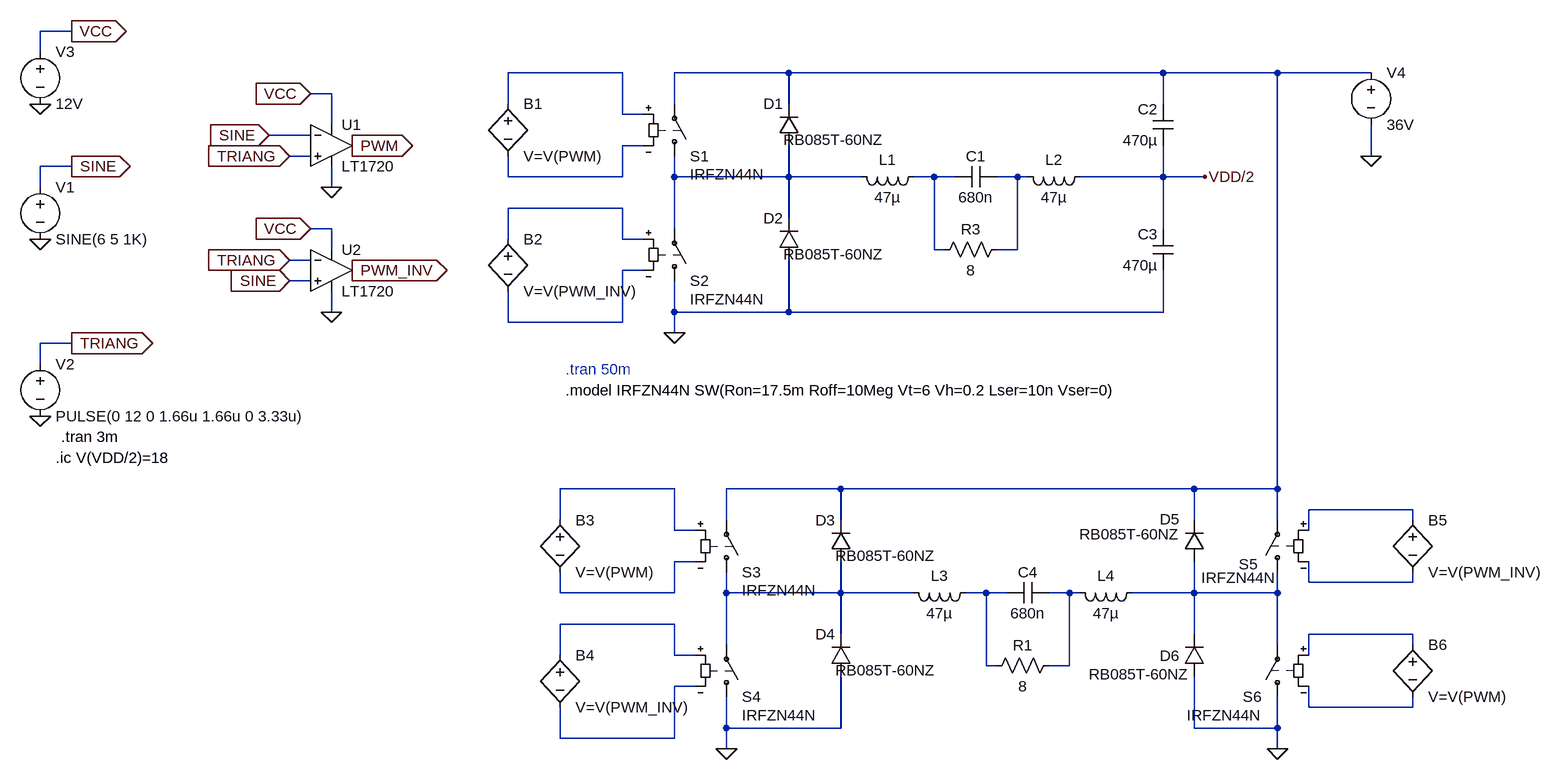
[diagram p0: schematic Draft1.asc]
Draft1.asc, the LTspice schematic file:
Version 4.1
SHEET 1 1736 832
WIRE -656 -416 -704 -416
WIRE -704 -384 -704 -416
WIRE 192 -352 16 -352
WIRE 448 -352 272 -352
WIRE 1024 -352 448 -352
WIRE 1200 -352 1024 -352
WIRE 1344 -352 1200 -352
WIRE -256 -320 -288 -320
WIRE 16 -304 16 -352
WIRE 272 -304 272 -352
WIRE 448 -304 448 -352
WIRE 1024 -304 1024 -352
WIRE 192 -288 192 -352
WIRE 224 -288 192 -288
WIRE -256 -272 -256 -320
WIRE -288 -256 -352 -256
WIRE 224 -240 192 -240
WIRE -288 -224 -320 -224
WIRE 1344 -224 1344 -272
WIRE -656 -208 -704 -208
WIRE 16 -192 16 -224
WIRE 192 -192 192 -240
WIRE 192 -192 16 -192
WIRE 272 -192 272 -224
WIRE 448 -192 448 -240
WIRE 448 -192 272 -192
WIRE 560 -192 448 -192
WIRE 672 -192 640 -192
WIRE 704 -192 672 -192
WIRE 800 -192 768 -192
WIRE 816 -192 800 -192
WIRE 1024 -192 1024 -240
WIRE 1024 -192 896 -192
WIRE 1088 -192 1024 -192
WIRE -704 -176 -704 -208
WIRE -256 -176 -256 -208
WIRE 192 -144 16 -144
WIRE 448 -128 448 -192
WIRE -256 -112 -288 -112
WIRE 272 -112 272 -192
WIRE 1024 -112 1024 -192
WIRE 16 -96 16 -144
WIRE 192 -96 192 -144
WIRE 224 -96 192 -96
WIRE -256 -80 -256 -112
WIRE 672 -80 672 -192
WIRE 688 -80 672 -80
WIRE 800 -80 800 -192
WIRE 800 -80 768 -80
WIRE -288 -64 -320 -64
WIRE 224 -48 192 -48
WIRE -288 -32 -320 -32
WIRE -256 16 -256 -16
WIRE 272 16 272 -32
WIRE 448 16 448 -64
WIRE 448 16 272 16
WIRE 1024 16 1024 -48
WIRE 1024 16 448 16
WIRE 16 32 16 -16
WIRE 192 32 192 -48
WIRE 192 32 16 32
WIRE 272 48 272 16
WIRE -656 64 -704 64
WIRE -704 96 -704 64
WIRE 272 288 96 288
WIRE 528 288 352 288
WIRE 1072 288 528 288
WIRE 1200 288 1200 -352
WIRE 1200 288 1072 288
WIRE 1408 320 1248 320
WIRE 96 336 96 288
WIRE 352 336 352 288
WIRE 528 336 528 288
WIRE 1072 336 1072 288
WIRE 1200 336 1200 288
WIRE 1408 336 1408 320
WIRE 272 352 272 288
WIRE 304 352 272 352
WIRE 1248 352 1248 320
WIRE 304 400 272 400
WIRE 1248 432 1248 400
WIRE 1408 432 1408 416
WIRE 1408 432 1248 432
WIRE 96 448 96 416
WIRE 272 448 272 400
WIRE 272 448 96 448
WIRE 352 448 352 416
WIRE 528 448 528 400
WIRE 528 448 352 448
WIRE 640 448 528 448
WIRE 752 448 720 448
WIRE 784 448 752 448
WIRE 880 448 848 448
WIRE 896 448 880 448
WIRE 1072 448 1072 400
WIRE 1072 448 976 448
WIRE 1200 448 1200 416
WIRE 1200 448 1072 448
WIRE 272 496 96 496
WIRE 528 512 528 448
WIRE 1072 512 1072 448
WIRE 1408 512 1248 512
WIRE 352 528 352 448
WIRE 1200 528 1200 448
WIRE 1408 528 1408 512
WIRE 96 544 96 496
WIRE 272 544 272 496
WIRE 304 544 272 544
WIRE 1248 544 1248 512
WIRE 752 560 752 448
WIRE 768 560 752 560
WIRE 880 560 880 448
WIRE 880 560 848 560
WIRE 304 592 272 592
WIRE 1248 624 1248 592
WIRE 1408 624 1408 608
WIRE 1408 624 1248 624
WIRE 352 656 352 608
WIRE 528 656 528 576
WIRE 528 656 352 656
WIRE 1072 656 1072 576
WIRE 1200 656 1200 608
WIRE 1200 656 1072 656
WIRE 96 672 96 624
WIRE 272 672 272 592
WIRE 272 672 96 672
WIRE 352 688 352 656
WIRE 1200 688 1200 656
FLAG -656 -416 VCC
IOPIN -656 -416 Out
FLAG -704 -304 0
FLAG -656 -208 SINE
IOPIN -656 -208 Out
FLAG -704 -96 0
FLAG -656 64 TRIANG
IOPIN -656 64 Out
FLAG -704 176 0
FLAG -288 -320 VCC
IOPIN -288 -320 In
FLAG -352 -256 SINE
IOPIN -352 -256 In
FLAG -320 -224 TRIANG
IOPIN -320 -224 In
FLAG -256 -176 0
FLAG -288 -112 VCC
IOPIN -288 -112 In
FLAG -320 -64 TRIANG
IOPIN -320 -64 In
FLAG -320 -32 SINE
IOPIN -320 -32 In
FLAG -256 16 0
FLAG -224 -48 PWM_INV
IOPIN -224 -48 Out
FLAG -224 -240 PWM
IOPIN -224 -240 Out
FLAG 1088 -192 VDD/2
FLAG 1344 -224 0
FLAG 272 48 0
FLAG 352 688 0
FLAG 1200 688 0
SYMBOL Comparators/LT1720 -256 -304 R0
SYMATTR InstName U1
SYMBOL Comparators/LT1720 -256 -112 R0
SYMATTR InstName U2
SYMBOL Voltage -704 -400 R0
SYMATTR InstName V3
SYMATTR Value 12V
SYMBOL Voltage -704 -192 R0
SYMATTR InstName V1
SYMATTR Value SINE(6 5 1K)
SYMBOL Voltage -704 80 R0
WINDOW 123 0 0 Left 0
WINDOW 39 0 0 Left 0
SYMATTR InstName V2
SYMATTR Value PULSE(0 12 0 1.66u 1.66u 0 3.33u)
SYMBOL sw 272 -208 M180
WINDOW 3 24 -12 Left 2
SYMATTR Value IRFZN44N
SYMATTR InstName S1
SYMBOL sw 272 -16 M180
WINDOW 3 24 -12 Left 2
SYMATTR Value IRFZN44N
SYMATTR InstName S2
SYMBOL diode 464 -240 R180
WINDOW 0 24 64 Left 2
WINDOW 3 -132 9 Left 2
SYMATTR InstName D1
SYMATTR Value RB085T-60NZ
SYMBOL diode 464 -64 R180
WINDOW 0 24 64 Left 2
WINDOW 3 -132 9 Left 2
SYMATTR InstName D2
SYMATTR Value RB085T-60NZ
SYMBOL ind 656 -208 R90
WINDOW 0 5 56 VBottom 2
WINDOW 3 32 56 VTop 2
SYMATTR InstName L1
SYMATTR Value 47µ
SYMATTR SpiceLine Rser=1m
SYMBOL ind 912 -208 R90
WINDOW 0 5 56 VBottom 2
WINDOW 3 32 56 VTop 2
SYMATTR InstName L2
SYMATTR Value 47µ
SYMATTR SpiceLine Rser=1m
SYMBOL cap 768 -208 R90
WINDOW 0 0 32 VBottom 2
WINDOW 3 32 32 VTop 2
SYMATTR InstName C1
SYMATTR Value 680n
SYMBOL cap 1040 -240 R180
WINDOW 0 24 56 Left 2
WINDOW 3 24 8 Left 2
SYMATTR InstName C2
SYMATTR Value 470µ
SYMBOL cap 1040 -48 R180
WINDOW 0 24 56 Left 2
WINDOW 3 24 8 Left 2
SYMATTR InstName C3
SYMATTR Value 470µ
SYMBOL voltage 1344 -368 R0
SYMATTR InstName V4
SYMATTR Value 36V
SYMBOL res 784 -96 R90
WINDOW 0 0 56 VBottom 2
WINDOW 3 32 56 VTop 2
SYMATTR InstName R3
SYMATTR Value 8
SYMBOL bv 16 -320 R0
SYMATTR InstName B1
SYMATTR Value V=V(PWM)
SYMBOL bv 16 -112 R0
SYMATTR InstName B2
SYMATTR Value V=V(PWM_INV)
SYMBOL sw 352 432 M180
WINDOW 3 24 -12 Left 2
SYMATTR Value IRFZN44N
SYMATTR InstName S3
SYMBOL sw 352 624 M180
WINDOW 3 24 -12 Left 2
SYMATTR Value IRFZN44N
SYMATTR InstName S4
SYMBOL diode 544 400 R180
WINDOW 0 24 64 Left 2
WINDOW 3 -132 9 Left 2
SYMATTR InstName D3
SYMATTR Value RB085T-60NZ
SYMBOL diode 544 576 R180
WINDOW 0 24 64 Left 2
WINDOW 3 -132 9 Left 2
SYMATTR InstName D4
SYMATTR Value RB085T-60NZ
SYMBOL ind 736 432 R90
WINDOW 0 5 56 VBottom 2
WINDOW 3 32 56 VTop 2
SYMATTR InstName L3
SYMATTR Value 47µ
SYMATTR SpiceLine Rser=1m
SYMBOL ind 992 432 R90
WINDOW 0 5 56 VBottom 2
WINDOW 3 32 56 VTop 2
SYMATTR InstName L4
SYMATTR Value 47µ
SYMATTR SpiceLine Rser=1m
SYMBOL cap 848 432 R90
WINDOW 0 0 32 VBottom 2
WINDOW 3 32 32 VTop 2
SYMATTR InstName C4
SYMATTR Value 680n
SYMBOL res 864 544 R90
WINDOW 0 0 56 VBottom 2
WINDOW 3 32 56 VTop 2
SYMATTR InstName R1
SYMATTR Value 8
SYMBOL bv 96 320 R0
SYMATTR InstName B3
SYMATTR Value V=V(PWM)
SYMBOL bv 96 528 R0
SYMATTR InstName B4
SYMATTR Value V=V(PWM_INV)
SYMBOL diode 1088 400 R180
WINDOW 0 38 65 Left 2
WINDOW 3 37 42 Left 2
SYMATTR InstName D5
SYMATTR Value RB085T-60NZ
SYMBOL diode 1088 576 R180
WINDOW 0 38 31 Left 2
WINDOW 3 22 3 Left 2
SYMATTR InstName D6
SYMATTR Value RB085T-60NZ
SYMBOL bv 1408 320 R0
SYMATTR InstName B5
SYMATTR Value V=V(PWM_INV)
SYMBOL bv 1408 512 R0
SYMATTR InstName B6
SYMATTR Value V=V(PWM)
SYMBOL sw 1200 432 R180
WINDOW 3 2 7 Left 2
WINDOW 0 30 28 Left 2
SYMATTR Value IRFZN44N
SYMATTR InstName S5
SYMBOL sw 1200 624 R180
WINDOW 3 24 -12 Left 2
SYMATTR Value IRFZN44N
SYMATTR InstName S6
TEXT 104 104 Left 2 ;.tran 50m
TEXT 104 136 Left 2 !.model IRFZN44N SW(Ron=17.5m Roff=10Meg Vt=6 Vh=0.2 Lser=10n Vser=0)
TEXT -680 240 Left 2 !.ic V(VDD/2)=18
TEXT -672 208 Left 2 !.tran 3m

The netlist it stands for:
* Draft1.asc
X§U1 TRIANG SINE VCC 0 PWM LT1720  ; pins In+ In- V+ V- OUT
X§U2 SINE TRIANG VCC 0 PWM_INV LT1720  ; pins In+ In- V+ V- OUT
V3 VCC 0 12V
V1 SINE 0 SINE(6 5 1K)
V2 TRIANG 0 PULSE(0 12 0 1.66u 1.66u 0 3.33u)
S1 N004 N002 N001 N003 IRFZN44N
S2 0 N004 N007 N008 IRFZN44N
D1 N004 N002 RB085T-60NZ
D2 0 N004 RB085T-60NZ
L1 N005 N004 47µ Rser=1m
L2 VDD/2 N006 47µ Rser=1m
C1 N006 N005 680n
C2 VDD/2 N002 470µ
C3 0 VDD/2 470µ
V4 N002 0 36V
R3 N006 N005 8
B1 N001 N003 V=V(PWM)
B2 N007 N008 V=V(PWM_INV)
S3 N013 N002 N009 N011 IRFZN44N
S4 0 N013 N017 N019 IRFZN44N
D3 N013 N002 RB085T-60NZ
D4 0 N013 RB085T-60NZ
L3 N014 N013 47µ Rser=1m
L4 N016 N015 47µ Rser=1m
C4 N015 N014 680n
R1 N015 N014 8
B3 N009 N011 V=V(PWM)
B4 N017 N019 V=V(PWM_INV)
D5 N016 N002 RB085T-60NZ
D6 0 N016 RB085T-60NZ
B5 N010 N012 V=V(PWM_INV)
B6 N018 N020 V=V(PWM)
S5 N016 N002 N010 N012 IRFZN44N
S6 0 N016 N018 N020 IRFZN44N
.model D D
.lib standard.dio
* .tran 50m
.model IRFZN44N SW(Ron=17.5m Roff=10Meg Vt=6 Vh=0.2 Lser=10n Vser=0)
.ic V(VDD/2)=18
.tran 3m
.lib LT1720.sub
.backanno
.end